# Altium schematic sheet DE-130817_03.SchDoc: PWM output
size A3; Author: eldar6776@hotmail.com; DrawnBy: Eldar Dedic; Organization: I-MEDIA GROUP d.o.o.; Address1: Topal Osman Paše 18; Address2: 71000 Sarajevo; Address3: Federacija BiH; Address4: Bosna i Hercegovina; DocumentNumber: DE-130817; Revision: 001
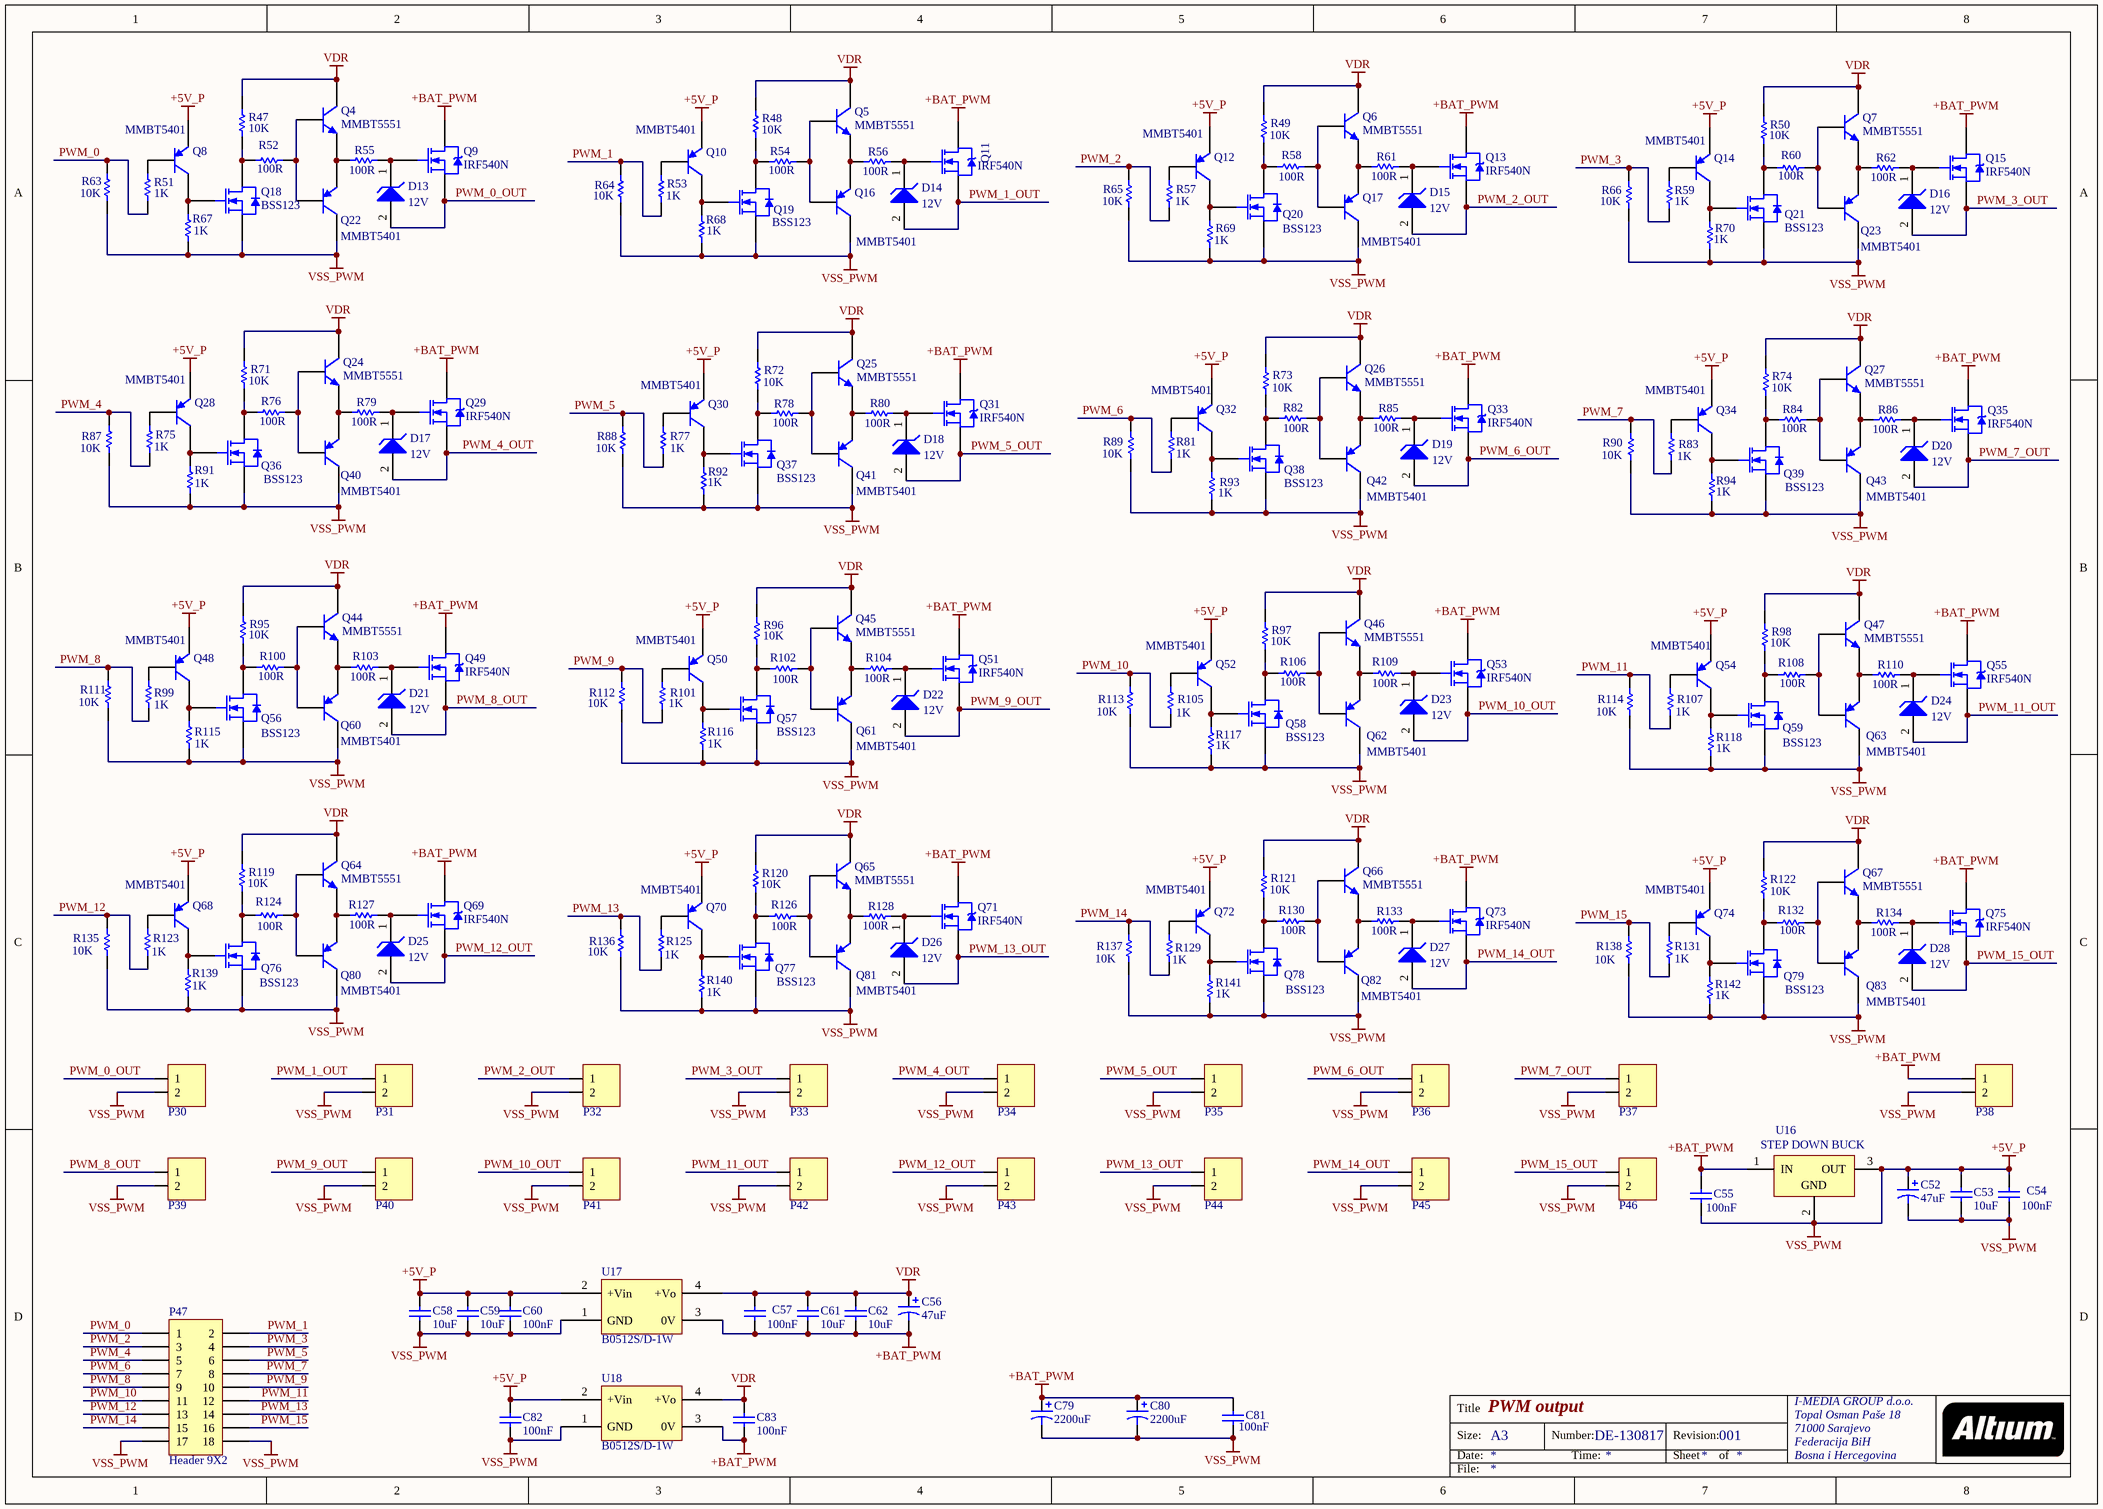
[diagram p0: DE-130817_03.SchDoc]

## Parts
C52  value 47uF  [CAPPR2-5X11]  (hidden comment: EKA00AA247F00)
C53  10uF  [0805]
C54  100nF  [0603]
C55  value 100nF  [VP52-2.5]  (hidden comment: VP52BY104)
C56  value 47uF  [CAPPR2-5X11]  (hidden comment: EKA00AA247F00)
C57  100nF  [0603]
C58  10uF  [0805]
C59  10uF  [0805]
C60  100nF  [0603]
C61  10uF  [0805]
C62  10uF  [0805]
C79  value 2200uF  [CAPPR7.5-16X35.5]  (hidden comment: EKA00JL422H00)
C80  value 2200uF  [CAPPR7.5-16X35.5]  (hidden comment: EKA00JL422H00)
C81  value 100nF  [VP60-3.6]  (hidden comment: VP60BA104FB)
C82  100nF  [0603]
C83  100nF  [0603]
D13  value 12V  [ONSC-SOD-123-2-425-04_V]  (hidden comment: SZMMSZ12T1G)
D14  value 12V  [ONSC-SOD-123-2-425-04_V]  (hidden comment: SZMMSZ12T1G)
D15  value 12V  [ONSC-SOD-123-2-425-04_V]  (hidden comment: SZMMSZ12T1G)
D16  value 12V  [ONSC-SOD-123-2-425-04_V]  (hidden comment: SZMMSZ12T1G)
D17  value 12V  [ONSC-SOD-123-2-425-04_V]  (hidden comment: SZMMSZ12T1G)
D18  value 12V  [ONSC-SOD-123-2-425-04_V]  (hidden comment: SZMMSZ12T1G)
D19  value 12V  [ONSC-SOD-123-2-425-04_V]  (hidden comment: SZMMSZ12T1G)
D20  value 12V  [ONSC-SOD-123-2-425-04_V]  (hidden comment: SZMMSZ12T1G)
D21  value 12V  [ONSC-SOD-123-2-425-04_V]  (hidden comment: SZMMSZ12T1G)
D22  value 12V  [ONSC-SOD-123-2-425-04_V]  (hidden comment: SZMMSZ12T1G)
D23  value 12V  [ONSC-SOD-123-2-425-04_V]  (hidden comment: SZMMSZ12T1G)
D24  value 12V  [ONSC-SOD-123-2-425-04_V]  (hidden comment: SZMMSZ12T1G)
D25  value 12V  [ONSC-SOD-123-2-425-04_V]  (hidden comment: SZMMSZ12T1G)
D26  value 12V  [ONSC-SOD-123-2-425-04_V]  (hidden comment: SZMMSZ12T1G)
D27  value 12V  [ONSC-SOD-123-2-425-04_V]  (hidden comment: SZMMSZ12T1G)
D28  value 12V  [ONSC-SOD-123-2-425-04_V]  (hidden comment: SZMMSZ12T1G)
P30  TERMINAL BLOK 2  [TERMINAL BLOK 2]  (value not drawn)
P31  TERMINAL BLOK 2  [TERMINAL BLOK 2]  (value not drawn)
P32  TERMINAL BLOK 2  [TERMINAL BLOK 2]  (value not drawn)
P33  TERMINAL BLOK 2  [TERMINAL BLOK 2]  (value not drawn)
P34  TERMINAL BLOK 2  [TERMINAL BLOK 2]  (value not drawn)
P35  TERMINAL BLOK 2  [TERMINAL BLOK 2]  (value not drawn)
P36  TERMINAL BLOK 2  [TERMINAL BLOK 2]  (value not drawn)
P37  TERMINAL BLOK 2  [TERMINAL BLOK 2]  (value not drawn)
P38  TERMINAL BLOK 2  [TERMINAL BLOK 2]  (value not drawn)
P39  TERMINAL BLOK 2  [TERMINAL BLOK 2]  (value not drawn)
P40  TERMINAL BLOK 2  [TERMINAL BLOK 2]  (value not drawn)
P41  TERMINAL BLOK 2  [TERMINAL BLOK 2]  (value not drawn)
P42  TERMINAL BLOK 2  [TERMINAL BLOK 2]  (value not drawn)
P43  TERMINAL BLOK 2  [TERMINAL BLOK 2]  (value not drawn)
P44  TERMINAL BLOK 2  [TERMINAL BLOK 2]  (value not drawn)
P45  TERMINAL BLOK 2  [TERMINAL BLOK 2]  (value not drawn)
P46  TERMINAL BLOK 2  [TERMINAL BLOK 2]  (value not drawn)
P47  Header 9X2  [HDR2X9]
Q4  MMBT5551  [SOT23_N]
Q5  MMBT5551  [SOT23_N]
Q6  MMBT5551  [SOT23_N]
Q7  MMBT5551  [SOT23_N]
Q8  MMBT5401  [SOT23_N]
Q9  IRF540N  [TO-220AB]
Q10  MMBT5401  [SOT23_N]
Q11  IRF540N  [TO-220AB]
Q12  MMBT5401  [SOT23_N]
Q13  IRF540N  [TO-220AB]
Q14  MMBT5401  [SOT23_N]
Q15  IRF540N  [TO-220AB]
Q16  MMBT5401  [SOT23_N]
Q17  MMBT5401  [SOT23_N]
Q18  BSS123  [SOT23_N]
Q19  BSS123  [SOT23_N]
Q20  BSS123  [SOT23_N]
Q21  BSS123  [SOT23_N]
Q22  MMBT5401  [SOT23_N]
Q23  MMBT5401  [SOT23_N]
Q24  MMBT5551  [SOT23_N]
Q25  MMBT5551  [SOT23_N]
Q26  MMBT5551  [SOT23_N]
Q27  MMBT5551  [SOT23_N]
Q28  MMBT5401  [SOT23_N]
Q29  IRF540N  [TO-220AB]
Q30  MMBT5401  [SOT23_N]
Q31  IRF540N  [TO-220AB]
Q32  MMBT5401  [SOT23_N]
Q33  IRF540N  [TO-220AB]
Q34  MMBT5401  [SOT23_N]
Q35  IRF540N  [TO-220AB]
Q36  BSS123  [SOT23_N]
Q37  BSS123  [SOT23_N]
Q38  BSS123  [SOT23_N]
Q39  BSS123  [SOT23_N]
Q40  MMBT5401  [SOT23_N]
Q41  MMBT5401  [SOT23_N]
Q42  MMBT5401  [SOT23_N]
Q43  MMBT5401  [SOT23_N]
Q44  MMBT5551  [SOT23_N]
Q45  MMBT5551  [SOT23_N]
Q46  MMBT5551  [SOT23_N]
Q47  MMBT5551  [SOT23_N]
Q48  MMBT5401  [SOT23_N]
Q49  IRF540N  [TO-220AB]
Q50  MMBT5401  [SOT23_N]
Q51  IRF540N  [TO-220AB]
Q52  MMBT5401  [SOT23_N]
Q53  IRF540N  [TO-220AB]
Q54  MMBT5401  [SOT23_N]
Q55  IRF540N  [TO-220AB]
Q56  BSS123  [SOT23_N]
Q57  BSS123  [SOT23_N]
Q58  BSS123  [SOT23_N]
Q59  BSS123  [SOT23_N]
Q60  MMBT5401  [SOT23_N]
Q61  MMBT5401  [SOT23_N]
Q62  MMBT5401  [SOT23_N]
Q63  MMBT5401  [SOT23_N]
Q64  MMBT5551  [SOT23_N]
Q65  MMBT5551  [SOT23_N]
Q66  MMBT5551  [SOT23_N]
Q67  MMBT5551  [SOT23_N]
Q68  MMBT5401  [SOT23_N]
Q69  IRF540N  [TO-220AB]
Q70  MMBT5401  [SOT23_N]
Q71  IRF540N  [TO-220AB]
Q72  MMBT5401  [SOT23_N]
Q73  IRF540N  [TO-220AB]
Q74  MMBT5401  [SOT23_N]
Q75  IRF540N  [TO-220AB]
Q76  BSS123  [SOT23_N]
Q77  BSS123  [SOT23_N]
Q78  BSS123  [SOT23_N]
Q79  BSS123  [SOT23_N]
Q80  MMBT5401  [SOT23_N]
Q81  MMBT5401  [SOT23_N]
Q82  MMBT5401  [SOT23_N]
Q83  MMBT5401  [SOT23_N]
R47  10K  [12-1812]
R48  10K  [12-1812]
R49  10K  [12-1812]
R50  10K  [12-1812]
R51  1K  [ERA-0805]
R52  100R  [ERA-0805]
R53  1K  [ERA-0805]
R54  100R  [ERA-0805]
R55  100R  [ERA-0805]
R56  100R  [ERA-0805]
R57  1K  [ERA-0805]
R58  100R  [ERA-0805]
R59  1K  [ERA-0805]
R60  100R  [ERA-0805]
R61  100R  [ERA-0805]
R62  100R  [ERA-0805]
R63  10K  [ERA-0805]
R64  10K  [ERA-0805]
R65  10K  [ERA-0805]
R66  10K  [ERA-0805]
R67  1K  [ERA-0805]
R68  1K  [ERA-0805]
R69  1K  [ERA-0805]
R70  1K  [ERA-0805]
R71  10K  [12-1812]
R72  10K  [12-1812]
R73  10K  [12-1812]
R74  10K  [12-1812]
R75  1K  [ERA-0805]
R76  100R  [ERA-0805]
R77  1K  [ERA-0805]
R78  100R  [ERA-0805]
R79  100R  [ERA-0805]
R80  100R  [ERA-0805]
R81  1K  [ERA-0805]
R82  100R  [ERA-0805]
R83  1K  [ERA-0805]
R84  100R  [ERA-0805]
R85  100R  [ERA-0805]
R86  100R  [ERA-0805]
R87  10K  [ERA-0805]
R88  10K  [ERA-0805]
R89  10K  [ERA-0805]
R90  10K  [ERA-0805]
R91  1K  [ERA-0805]
R92  1K  [ERA-0805]
R93  1K  [ERA-0805]
R94  1K  [ERA-0805]
R95  10K  [12-1812]
R96  10K  [12-1812]
R97  10K  [12-1812]
R98  10K  [12-1812]
R99  1K  [ERA-0805]
R100  100R  [ERA-0805]
R101  1K  [ERA-0805]
R102  100R  [ERA-0805]
R103  100R  [ERA-0805]
R104  100R  [ERA-0805]
R105  1K  [ERA-0805]
R106  100R  [ERA-0805]
R107  1K  [ERA-0805]
R108  100R  [ERA-0805]
R109  100R  [ERA-0805]
R110  100R  [ERA-0805]
R111  10K  [ERA-0805]
R112  10K  [ERA-0805]
R113  10K  [ERA-0805]
R114  10K  [ERA-0805]
R115  1K  [ERA-0805]
R116  1K  [ERA-0805]
R117  1K  [ERA-0805]
R118  1K  [ERA-0805]
R119  10K  [12-1812]
R120  10K  [12-1812]
R121  10K  [12-1812]
R122  10K  [12-1812]
R123  1K  [ERA-0805]
R124  100R  [ERA-0805]
R125  1K  [ERA-0805]
R126  100R  [ERA-0805]
R127  100R  [ERA-0805]
R128  100R  [ERA-0805]
R129  1K  [ERA-0805]
R130  100R  [ERA-0805]
R131  1K  [ERA-0805]
R132  100R  [ERA-0805]
R133  100R  [ERA-0805]
R134  100R  [ERA-0805]
R135  10K  [ERA-0805]
R136  10K  [ERA-0805]
R137  10K  [ERA-0805]
R138  10K  [ERA-0805]
R139  1K  [ERA-0805]
R140  1K  [ERA-0805]
R141  1K  [ERA-0805]
R142  1K  [ERA-0805]
U16  STEP DOWN BUCK  [TO220]
U17  B0512S/D-1W  [B0505S-1W]
U18  B0512S/D-1W  [B0505S-1W]

## Nets
+5V_P: C52.1 C52.2 C53.1 C53.2 C54.1 C54.2 C55.1 C58.1 C58.2 C59.1 C59.2 C60.1 C60.2 C79.2 C80.2 C81.1 C82.1 C82.2 P30.2 P31.2 P32.2 P33.2 P34.2 P35.2 P36.2 P37.2 P38.2 P39.2 P40.2 P41.2 P42.2 P43.2 P44.2 P45.2 P46.2 P47.17 P47.18 Q8.2(E) Q10.2(E) Q12.2(E) Q14.2(E) Q16.3(C) Q17.3(C) Q18.2(S) Q19.2(S) Q20.2(S) Q21.2(S) Q22.3(C) Q23.3(C) Q28.2(E) Q30.2(E) Q32.2(E) Q34.2(E) Q36.2(S) Q37.2(S) Q38.2(S) Q39.2(S) Q40.3(C) Q41.3(C) Q42.3(C) Q43.3(C) Q48.2(E) Q50.2(E) Q52.2(E) Q54.2(E) Q56.2(S) Q57.2(S) Q58.2(S) Q59.2(S) Q60.3(C) Q61.3(C) Q62.3(C) Q63.3(C) Q68.2(E) Q70.2(E) Q72.2(E) Q74.2(E) Q76.2(S) Q77.2(S) Q78.2(S) Q79.2(S) Q80.3(C) Q81.3(C) Q82.3(C) Q83.3(C) R63.1 R64.1 R65.1 R66.1 R67.2 R68.2 R69.2 R70.2 R87.1 R88.1 R89.1 R90.1 R91.2 R92.2 R93.2 R94.2 R111.1 R112.1 R113.1 R114.1 R115.2 R116.2 R117.2 R118.2 R135.1 R136.1 R137.1 R138.1 R139.2 R140.2 R141.2 R142.2 U16.2(GND) U16.3(OUT) U17.1(GND) U17.2(+Vin) U18.1(GND) U18.2(+Vin)  [also labelled VSS_PWM]
+BAT_PWM: C55.2 C56.2 C57.1 C61.1 C62.1 C79.1 C80.1 C81.2 C83.1 P38.1 Q9.2(D) Q11.2(D) Q13.2(D) Q15.2(D) Q29.2(D) Q31.2(D) Q33.2(D) Q35.2(D) Q49.2(D) Q51.2(D) Q53.2(D) Q55.2(D) Q69.2(D) Q71.2(D) Q73.2(D) Q75.2(D) U16.1(IN) U17.3(0V) U18.3(0V)
VDR: C56.1 C57.2 C61.2 C62.2 C83.2 Q4.3(C) Q5.3(C) Q6.3(C) Q7.3(C) Q24.3(C) Q25.3(C) Q26.3(C) Q27.3(C) Q44.3(C) Q45.3(C) Q46.3(C) Q47.3(C) Q64.3(C) Q65.3(C) Q66.3(C) Q67.3(C) R47.2 R48.2 R49.2 R50.2 R71.2 R72.2 R73.2 R74.2 R95.2 R96.2 R97.2 R98.2 R119.2 R120.2 R121.2 R122.2 U17.4(+Vo) U18.4(+Vo)
PWM_0: P47.1 R51.1 R63.2
PWM_0_OUT: D13.2(A) P30.1 Q9.3(S)
PWM_1: P47.2 R53.1 R64.2
PWM_1_OUT: D14.2(A) P31.1 Q11.3(S)
PWM_2: P47.3 R57.1 R65.2
PWM_2_OUT: D15.2(A) P32.1 Q13.3(S)
PWM_3: P47.4 R59.1 R66.2
PWM_3_OUT: D16.2(A) P33.1 Q15.3(S)
PWM_4: P47.5 R75.1 R87.2
PWM_4_OUT: D17.2(A) P34.1 Q29.3(S)
PWM_5: P47.6 R77.1 R88.2
PWM_5_OUT: D18.2(A) P35.1 Q31.3(S)
PWM_6: P47.7 R81.1 R89.2
PWM_6_OUT: D19.2(A) P36.1 Q33.3(S)
PWM_7: P47.8 R83.1 R90.2
PWM_7_OUT: D20.2(A) P37.1 Q35.3(S)
PWM_8: P47.9 R99.1 R111.2
PWM_8_OUT: D21.2(A) P39.1 Q49.3(S)
PWM_9: P47.10 R101.1 R112.2
PWM_9_OUT: D22.2(A) P40.1 Q51.3(S)
PWM_10: P47.11 R105.1 R113.2
PWM_10_OUT: D23.2(A) P41.1 Q53.3(S)
PWM_11: P47.12 R107.1 R114.2
PWM_11_OUT: D24.2(A) P42.1 Q55.3(S)
PWM_12: P47.13 R123.1 R135.2
PWM_12_OUT: D25.2(A) P43.1 Q69.3(S)
PWM_13: P47.14 R125.1 R136.2
PWM_13_OUT: D26.2(A) P44.1 Q71.3(S)
PWM_14: P47.15 R129.1 R137.2
PWM_14_OUT: D27.2(A) P45.1 Q73.3(S)
PWM_15: P47.16 R131.1 R138.2
PWM_15_OUT: D28.2(A) P46.1 Q75.3(S)
NetD13_1: D13.1(K) Q9.1(G) R55.2
NetD14_1: D14.1(K) Q11.1(G) R56.2
NetD15_1: D15.1(K) Q13.1(G) R61.2
NetD16_1: D16.1(K) Q15.1(G) R62.2
NetD17_1: D17.1(K) Q29.1(G) R79.2
NetD18_1: D18.1(K) Q31.1(G) R80.2
NetD19_1: D19.1(K) Q33.1(G) R85.2
NetD20_1: D20.1(K) Q35.1(G) R86.2
NetD21_1: D21.1(K) Q49.1(G) R103.2
NetD22_1: D22.1(K) Q51.1(G) R104.2
NetD23_1: D23.1(K) Q53.1(G) R109.2
NetD24_1: D24.1(K) Q55.1(G) R110.2
NetD25_1: D25.1(K) Q69.1(G) R127.2
NetD26_1: D26.1(K) Q71.1(G) R128.2
NetD27_1: D27.1(K) Q73.1(G) R133.2
NetD28_1: D28.1(K) Q75.1(G) R134.2
NetQ4_1: Q4.1(B) Q22.1(B) R52.1
NetQ4_2: Q4.2(E) Q22.2(E) R55.1
NetQ5_1: Q5.1(B) Q16.1(B) R54.1
NetQ5_2: Q5.2(E) Q16.2(E) R56.1
NetQ6_1: Q6.1(B) Q17.1(B) R58.1
NetQ6_2: Q6.2(E) Q17.2(E) R61.1
NetQ7_1: Q7.1(B) Q23.1(B) R60.1
NetQ7_2: Q7.2(E) Q23.2(E) R62.1
NetQ8_1: Q8.1(B) R51.2
NetQ8_3: Q8.3(C) Q18.1(G) R67.1
NetQ10_1: Q10.1(B) R53.2
NetQ10_3: Q10.3(C) Q19.1(G) R68.1
NetQ12_1: Q12.1(B) R57.2
NetQ12_3: Q12.3(C) Q20.1(G) R69.1
NetQ14_1: Q14.1(B) R59.2
NetQ14_3: Q14.3(C) Q21.1(G) R70.1
NetQ18_3: Q18.3(D) R47.1 R52.2
NetQ19_3: Q19.3(D) R48.1 R54.2
NetQ20_3: Q20.3(D) R49.1 R58.2
NetQ21_3: Q21.3(D) R50.1 R60.2
NetQ24_1: Q24.1(B) Q40.1(B) R76.1
NetQ24_2: Q24.2(E) Q40.2(E) R79.1
NetQ25_1: Q25.1(B) Q41.1(B) R78.1
NetQ25_2: Q25.2(E) Q41.2(E) R80.1
NetQ26_1: Q26.1(B) Q42.1(B) R82.1
NetQ26_2: Q26.2(E) Q42.2(E) R85.1
NetQ27_1: Q27.1(B) Q43.1(B) R84.1
NetQ27_2: Q27.2(E) Q43.2(E) R86.1
NetQ28_1: Q28.1(B) R75.2
NetQ28_3: Q28.3(C) Q36.1(G) R91.1
NetQ30_1: Q30.1(B) R77.2
NetQ30_3: Q30.3(C) Q37.1(G) R92.1
NetQ32_1: Q32.1(B) R81.2
NetQ32_3: Q32.3(C) Q38.1(G) R93.1
NetQ34_1: Q34.1(B) R83.2
NetQ34_3: Q34.3(C) Q39.1(G) R94.1
NetQ36_3: Q36.3(D) R71.1 R76.2
NetQ37_3: Q37.3(D) R72.1 R78.2
NetQ38_3: Q38.3(D) R73.1 R82.2
NetQ39_3: Q39.3(D) R74.1 R84.2
NetQ44_1: Q44.1(B) Q60.1(B) R100.1
NetQ44_2: Q44.2(E) Q60.2(E) R103.1
NetQ45_1: Q45.1(B) Q61.1(B) R102.1
NetQ45_2: Q45.2(E) Q61.2(E) R104.1
NetQ46_1: Q46.1(B) Q62.1(B) R106.1
NetQ46_2: Q46.2(E) Q62.2(E) R109.1
NetQ47_1: Q47.1(B) Q63.1(B) R108.1
NetQ47_2: Q47.2(E) Q63.2(E) R110.1
NetQ48_1: Q48.1(B) R99.2
NetQ48_3: Q48.3(C) Q56.1(G) R115.1
NetQ50_1: Q50.1(B) R101.2
NetQ50_3: Q50.3(C) Q57.1(G) R116.1
NetQ52_1: Q52.1(B) R105.2
NetQ52_3: Q52.3(C) Q58.1(G) R117.1
NetQ54_1: Q54.1(B) R107.2
NetQ54_3: Q54.3(C) Q59.1(G) R118.1
NetQ56_3: Q56.3(D) R95.1 R100.2
NetQ57_3: Q57.3(D) R96.1 R102.2
NetQ58_3: Q58.3(D) R97.1 R106.2
NetQ59_3: Q59.3(D) R98.1 R108.2
NetQ64_1: Q64.1(B) Q80.1(B) R124.1
NetQ64_2: Q64.2(E) Q80.2(E) R127.1
NetQ65_1: Q65.1(B) Q81.1(B) R126.1
NetQ65_2: Q65.2(E) Q81.2(E) R128.1
NetQ66_1: Q66.1(B) Q82.1(B) R130.1
NetQ66_2: Q66.2(E) Q82.2(E) R133.1
NetQ67_1: Q67.1(B) Q83.1(B) R132.1
NetQ67_2: Q67.2(E) Q83.2(E) R134.1
NetQ68_1: Q68.1(B) R123.2
NetQ68_3: Q68.3(C) Q76.1(G) R139.1
NetQ70_1: Q70.1(B) R125.2
NetQ70_3: Q70.3(C) Q77.1(G) R140.1
NetQ72_1: Q72.1(B) R129.2
NetQ72_3: Q72.3(C) Q78.1(G) R141.1
NetQ74_1: Q74.1(B) R131.2
NetQ74_3: Q74.3(C) Q79.1(G) R142.1
NetQ76_3: Q76.3(D) R119.1 R124.2
NetQ77_3: Q77.3(D) R120.1 R126.2
NetQ78_3: Q78.3(D) R121.1 R130.2
NetQ79_3: Q79.3(D) R122.1 R132.2

## Notes on the sheet
- Title
- Size:
- Date:
- A3
- Number:
- Time:
- Revision:
- Sheet
- of
- File:

## Library data of the parts
C52 C56 = EKA00AA247F00: Aluminum Electrolytic Capacitor, Radial Style with Long Leads: 47uF, 35V; Note: Refer to Manufacturer's Data Sheets for other lead formations; DrillSize: Nominal, Rounded To The Nearest 0.1mm; Published: 19-Mar-2004; DatasheetDocument: 20-Feb-2001; PackageReference: CAPPR2-5X11; Publisher: Altium Limited; ComponentLink1Description: Manufacturer Link; ComponentLink1URL: http://www.vishay.com/; ComponentLink2Description: Datasheet; ComponentLink2URL: http://www.vishay.com/docs/25014/eka.pdf
C53 C58 C59 C61 C62 = C0805: Ceramic Chip Capacitor - Standard; Note: Footprint corresponds to dimensions for bulk cassette packaging. This case size has tightened tolerances.; Published: 17-Jul-2002; LatestRevisionDate: 19-Mar-2004; LatestRevisionNote: Silkscreen size reduced.; DatasheetDocument: Mar-2001; PackageDocument: Mar-2001; PackageReference: 0805; Publisher: Altium Limited; Code_JEITA: 0805; Code_IPC: 2012[0805]; ComponentLink1Description: Manufacturer Link; ComponentLink1URL: http://www.kemet.com/; ComponentLink2Description: Datasheet; ComponentLink2URL: http://www.kemet.com/kemet/web/homepage/kechome.nsf/vapubfilesname/F3102TA.pdf/$file/F3102TA.pdf
C54 C57 C60 C82 C83 = C0603: Ceramic Chip Capacitor - Standard; Note: Footprint corresponds to dimensions for bulk cassette packaging. This case size has tightened tolerances.; Published: 17-Jul-2002; LatestRevisionDate: 19-Mar-2004; LatestRevisionNote: Silkscreen size reduced.; DatasheetDocument: Mar-2001; PackageDocument: Mar-2001; PackageReference: 0603; Publisher: Altium Limited; Code_JEITA: 0603; Code_IPC: 1608 [0603]; ComponentLink1Description: Manufacturer Link; ComponentLink1URL: http://www.kemet.com/; ComponentLink2Description: Datasheet; ComponentLink2URL: http://www.kemet.com/kemet/web/homepage/kechome.nsf/vapubfilesname/F3102TA.pdf/$file/F3102TA.pdf
C55 = VP52BY104: Dipped Radial Multilayer Ceramic Capacitor X7R: 100nF; Note: See Datasheet for other packages & tolerances; Published: 17-Dec-2003; DatasheetDocument: 4-Feb-2002; PackageDocument: 4-Feb-2002; PackageReference: VP52-2.5; Publisher: Altium Limited; ComponentLink1Description: Manufacturer Link; ComponentLink1URL: http://www.vishay.com/
C79 C80 = EKA00JL422H00: Aluminum Electrolytic Capacitor, Radial Style with Long Leads: 2200uF, 50V; Note: Refer to Manufacturer's Data Sheets for other lead formations; DrillSize: Nominal, Rounded To The Nearest 0.1mm; Published: 19-Mar-2004; DatasheetDocument: 20-Feb-2001; PackageReference: CAPPR7.5-16X35.5; Publisher: Altium Limited; ComponentLink1Description: Manufacturer Link; ComponentLink1URL: http://www.vishay.com/; ComponentLink2Description: Datasheet; ComponentLink2URL: http://www.vishay.com/docs/25014/eka.pdf
C81 = VP60BA104FB: Dipped Radial Multilayer Ceramic Capacitor COG (NPO): 100nF, 100V; Published: 17-Dec-2003; LatestRevisionDate: 19-Mar-2004; LatestRevisionNote: PCB Footprint - Drill hole diameter reduced.; DatasheetDocument: 2-Jan-2002; PackageDocument: 2-Jan-2002; PackageReference: VP60-3.6; Publisher: Altium Limited; ComponentLink1Description: Manufacturer Link; ComponentLink1URL: http://www.vishay.com/
D13-D28 = SZMMSZ12T1G: Zener Voltage Regulator, 500 mW, 2-Pin SOD-123, Pb-Free, Tape and Reel; Manufacturer: On Semiconductor; P Max (W): 0.5; DatasheetVersion: Rev. 11; PackageVersion: Rev. G, 10/2009; PackageReference: SOD-123-2-425-04; PackageDescription: 2-Pin SOD, Body 1.6 x 2.69 mm; Supplier 1: Digi-Key; Supplier Part Number 1: SZMMSZ12T1G-ND; Supplier 2: Mouser; Supplier Part Number 2: 863-SZMMSZ12T1G; Packing: Tape and Reel; RoHS: Pb-Free; Mounting Technology: Surface Mount; PartNumber: SZMMSZ12T1G; ComponentLink1Description: Manufacturer URL; ComponentLink1URL: http://www.onsemi.com/; ComponentLink2Description: Datasheet; ComponentLink2URL: http://www.onsemi.com/pub_link/Collateral/MMSZ2V4T1-D.PDF; ComponentLink3Description: Package Specification; ComponentLink3URL: http://www.onsemi.com/pub_link/Collateral/425-04.PDF
P30-P46 = TERMINAL BLOK 2: 2 pinski terminal blok
P47 = Header 9X2: Header, 9-Pin, Dual row; LatestRevisionDate: 17-Jul-2002; LatestRevisionNote: Re-released for DXP Platform.; Publisher: Altium Limited
Q4-Q7 Q24-Q27 Q44-Q47 Q64-Q67 = BC817: NPN General-purpose Transistor; Published: 17-Sep-2003; LatestRevisionDate: 12-Dec-2006; LatestRevisionNote: IPC-7351 Footprint Added.; DatasheetVersion: Jun-1999; PackageVersion: May-1999; PackageReference: SOT23; Publisher: Altium Limited; PackageDescription: 3-Pin SOT-23 Package 0.95 mm Pitch, 2.3 mm Lead Span; ComponentLink1Description: Manufacturer Link; ComponentLink1URL: http://www.semiconductors.philips.com/; ComponentLink2Description: Datasheet; ComponentLink2URL: http://www.semiconductors.philips.com/acrobat/datasheets/BC817_BC817W_BC337_5.pdf
Q8 Q10 Q12 Q14 Q16 Q17 Q22 Q23 Q28 Q30 Q32 Q34 Q40-Q43 Q48 Q50 Q52 Q54 Q60-Q63 Q68 Q70 Q72 Q74 Q80-Q83 = BC807: PNP General-purpose Transistor; Published: 17-Sep-2003; LatestRevisionDate: 12-Dec-2006; LatestRevisionNote: IPC-7351 Footprint Added.; DatasheetVersion: 8-Apr-1999; PackageVersion: May-1999; PackageReference: SOT23; Publisher: Altium Limited; PackageDescription: 3-Pin SOT-23 Package 0.95 mm Pitch, 2.3 mm Lead Span; ComponentLink1Description: Manufacturer Link; ComponentLink1URL: http://www.semiconductors.philips.com/; ComponentLink2Description: Datasheet; ComponentLink2URL: http://www.semiconductors.philips.com/acrobat/datasheets/BC807_BC807W_BC327_5.pdf
Q9 Q11 Q13 Q15 Q29 Q31 Q33 Q35 Q49 Q51 Q53 Q55 Q69 Q71 Q73 Q75 = IRF540N: HEXFET Power MOSFET; Note: Pin 2 is electrically connected to pin 4.; Sim Note: Thermal Model provided is not called on from main Subckt.; Published: 8-Jun-2000; LatestRevisionDate: 17-Jul-2002; LatestRevisionNote: Re-released for DXP Platform.; DatasheetVersion: May-1998; PackageVersion: Feb-1997; PackageReference: TO-220AB; Publisher: Altium Limited; PackageDescription: TO, Thru-Hole, Vertical, Heatsink Mounted; 3 In-Line Leads; Pitch 2.54 mm; ComponentLink1Description: Manufacturer Link; ComponentLink1URL: http://www.irf.com/; ComponentLink2Description: Datasheet; ComponentLink2URL: http://www.irf.com/product-info/datasheets/data/irf540n.pdf
Q18-Q21 Q36-Q39 Q56-Q59 Q76-Q79 = BSS123: N-channel Enhancement Mode Vertical D-MOSFET; Published: 17-Sep-2003; LatestRevisionDate: 12-Dec-2006; LatestRevisionNote: IPC-7351 Footprint Added.; DatasheetVersion: Apr-1995; PackageVersion: May-1999; PackageReference: SOT23; Publisher: Altium Limited; PackageDescription: 3-Pin SOT-23 Package 0.95 mm Pitch, 2.3 mm Lead Span; ComponentLink1Description: Manufacturer Link; ComponentLink1URL: http://www.semiconductors.philips.com/; ComponentLink2Description: Datasheet; ComponentLink2URL: http://www.semiconductors.philips.com/acrobat/datasheets/BSS123_3.pdf
R47-R50 R71-R74 R95-R98 R119-R122 = ERJ12: Thick Film Chip Resistor, 1 Ohm to 10M Ohm Range, 5% Tolerance, 1812 Size, 0.5 W; Note: If flow soldering, adjust pad width of PCB Footprint to 0.7 - 0.8 times the width of the resistor.; Published: 17-Dec-2003; LatestRevisionDate: 19-Mar-2004; LatestRevisionNote: Silkscreen size reduced.; PackageDocument: Mar-2003; PackageReference: 12-1812; Publisher: Altium Limited; ComponentLink1Description: Manufacturer Link; ComponentLink1URL: http://www.panasonic.com/industrial/components/resistive_products.htm; ComponentLink2Description: Datasheet; ComponentLink2URL: http://www.panasonic.com/industrial/components/pdf/AOA0000CE1.pdf; Value: 10K
R51-R70 R75-R94 R99-R118 R123-R142 = ERA6Y: Rectangular Thick Film Chip Resistor, 10 Ohm to 1M Ohm Range, 0.1% and 0.5% Tolerance, 0805 Size, 0.1 W; Note: If flow soldering, adjust pad width of PCB Footprint to 0.7 - 0.8 times the width of the resistor.; Published: 17-Dec-2003; LatestRevisionDate: 19-Mar-2004; LatestRevisionNote: Silkscreen size reduced.; PackageDocument: Mar-2003; PackageReference: ERA-0805; Publisher: Altium Limited; Code_IPC: 2012 [0805]; ComponentLink1Description: Manufacturer Link; ComponentLink1URL: http://www.panasonic.com/industrial/components/resistive_products.htm; ComponentLink2Description: Datasheet; ComponentLink2URL: http://www.panasonic.com/industrial/components/pdf/AOA0000CE8.pdf
  R51 R53 R57 R59 R67-R70 R75 R77 R81 R83 R91-R94 R99 R101 R105 R107 R115-R118 R123 R125 R129 R131 R139-R142: Value: 1K
  R52 R54-R56 R58 R60-R62 R76 R78-R80 R82 R84-R86 R100 R102-R104 R106 R108-R110 R124 R126-R128 R130 R132-R134: Value: 100R
  R63-R66 R87-R90 R111-R114 R135-R138: Value: 10K
U16 = L7805CV: Positive Voltage Regulator, 5V, 3-Pin TO-220; DatasheetVersion: Nov-2011; PackageVersion: ver3.0; PackageReference: TO220; PackageDescription: TO, Thru-Hole, Vertical, Heatsink Mounted; 3 In-Line Leads; Pitch 2.54 mm; PartNumber: L7805CV; ComponentLink1Description: Manufacturer URL; ComponentLink1URL: http://www.st.com; ComponentLink2Description: Datasheet; ComponentLink2URL: http://www.st.com/internet/com/TECHNICAL_RESOURCES/TECHNICAL_LITERATURE/DATASHEET/CD00000444.pdf; ComponentLink3Description: Package Specification; ComponentLink3URL: http://www.st.com/internet/com/TECHNICAL_RESOURCES/TECHNICAL_LITERATURE/PACKAGE_INFORMATION/CD00004649.pdf
U17 U18 = B0505S/D: 1W isolated dc dc converter